# Altium schematic sheet DC-Link-Caps.SchDoc
size A4; CompanyName: Technische Hochschule Nürnberg Georg Simon Ohm; Organization: UltraZohm; Address1: Kesslerplatz 12; Address2: 90489 Nürnberg; Address3: GERMANY; SheetNumber: 7; SheetTotal: 9; Website: www.ultrazohm.com
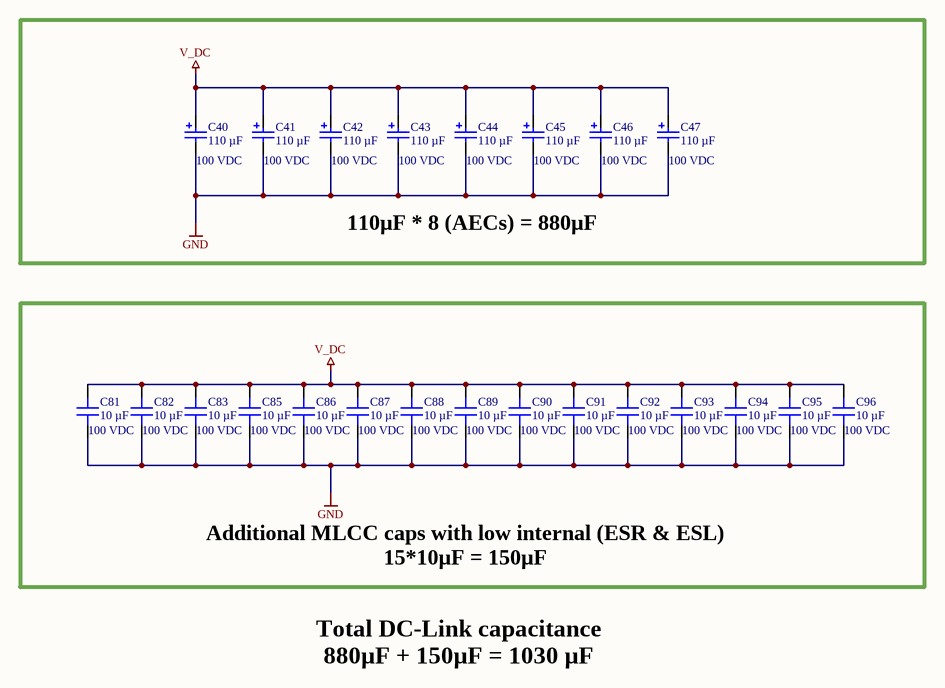
[diagram p0: DC-Link-Caps.SchDoc]

## Parts
C40  110 µF  Voltage Rating: 100 VDC  [CAPAE1300X1400N]
C41  110 µF  Voltage Rating: 100 VDC  [CAPAE1300X1400N]
C42  110 µF  Voltage Rating: 100 VDC  [CAPAE1300X1400N]
C43  110 µF  Voltage Rating: 100 VDC  [CAPAE1300X1400N]
C44  110 µF  Voltage Rating: 100 VDC  [CAPAE1300X1400N]
C45  110 µF  Voltage Rating: 100 VDC  [CAPAE1300X1400N]
C46  110 µF  Voltage Rating: 100 VDC  [CAPAE1300X1400N]
C47  110 µF  Voltage Rating: 100 VDC  [CAPAE1300X1400N]
C81  10 µF  Voltage Rating: 100 VDC  [C_1210_N]
C82  10 µF  Voltage Rating: 100 VDC  [C_1210_N]
C83  10 µF  Voltage Rating: 100 VDC  [C_1210_N]
C85  10 µF  Voltage Rating: 100 VDC  [C_1210_N]
C86  10 µF  Voltage Rating: 100 VDC  [C_1210_N]
C87  10 µF  Voltage Rating: 100 VDC  [C_1210_N]
C88  10 µF  Voltage Rating: 100 VDC  [C_1210_N]
C89  10 µF  Voltage Rating: 100 VDC  [C_1210_N]
C90  10 µF  Voltage Rating: 100 VDC  [C_1210_N]
C91  10 µF  Voltage Rating: 100 VDC  [C_1210_N]
C92  10 µF  Voltage Rating: 100 VDC  [C_1210_N]
C93  10 µF  Voltage Rating: 100 VDC  [C_1210_N]
C94  10 µF  Voltage Rating: 100 VDC  [C_1210_N]
C95  10 µF  Voltage Rating: 100 VDC  [C_1210_N]
C96  10 µF  Voltage Rating: 100 VDC  [C_1210_N]

## Nets
GND: C40.2(N) C41.2(N) C42.2(N) C43.2(N) C44.2(N) C45.2(N) C46.2(N) C47.2(N) C81.1 C82.1 C83.1 C85.1 C86.1 C87.1 C88.1 C89.1 C90.1 C91.1 C92.1 C93.1 C94.1 C95.1 C96.1
V_DC: C40.1(P) C41.1(P) C42.1(P) C43.1(P) C44.1(P) C45.1(P) C46.1(P) C47.1(P) C81.2 C82.2 C83.2 C85.2 C86.2 C87.2 C88.2 C89.2 C90.2 C91.2 C92.2 C93.2 C94.2 C95.2 C96.2

## Notes on the sheet
- 110µF * 8 (AECs) = 880µF
- Additional MLCC caps with low internal (ESR & ESL)
  15*10µF = 150µF
- Total DC-Link capacitance
  880µF + 150µF = 1030 µF
- Title
- Revision:
- Design Engineer:
- Date:
- Project:
- Sheet
- of

## Library data of the parts
C40-C47 = EMHS101ARA111MKE0S: Capacitor, 110µF, 100VDC Al Electrolyt; Manufacturer: CHEMI-CON; Tolerance: 20%; Created from: KPatel; Manufacturer Part Number: EMHS101ARA111MKE0S; PartID: 149; Created On: 6/7/2024 2:59:53 PM; ComponentLink1Description: Datasheet; ComponentLink1URL: https://www.lcsc.com/datasheet/lcsc_datasheet_2401161155_NCC-Nippon-Chemi-Con-EMHS101ARA111MKE0S_C2163387.pdf; Component Type: Capacitor Al Electrolyt; Device Package: KE0; Last Updated: 6/7/2024 2:59:53 PM; Mounting Type: SMD; Operating Temperature: -40 - 125° C; Series: MHS; Supplier 1: Mouser; Supplier Part Number 1: 661-EMHS101ARA111MKE; Supplier 2: LCSC; Supplier Part Number 2: C2163387; Type: Capacitor; Value: 110 µF; Live Cycle Status: 1; LCSC Part Number: C2163387; Stock number: not stored
C81-C83 C85-C96 = GRM32EC72A106KE05L: Capacitor 1210, 100 VDC, 10µF, X7S; Manufacturer: Murata Electronics; Tolerance: 10 %; Created from: DHufnagel; Manufacturer Part Number: GRM32EC72A106KE05L; PartID: 118; Created On: 21.12.2022 14:25:08; ComponentLink1Description: Datasheet; ComponentLink1URL: https://www.mouser.de/datasheet/2/281/1/GRM32EC72A106KE05_01A-1988109.pdf; Component Type: Capacitor 1210; Device Package: 1210; Last Updated: 21.02.2024 14:40:52; Mounting Type: SMD; Operating Temperature: -55 - 125°C; Series: GRM; Supplier 1: Mouser; Supplier Part Number 1: 81-GRM32EC72A106KE05; Type: Capacitor; Value: 10 µF; Live Cycle Status: 1; Stock number: not stored; Supplier 2: LCSC; Supplier Part Number 2: C576517; LCSC Part Number: C576517